# Altium schematic sheet step-dir-single.SchDoc
size A4
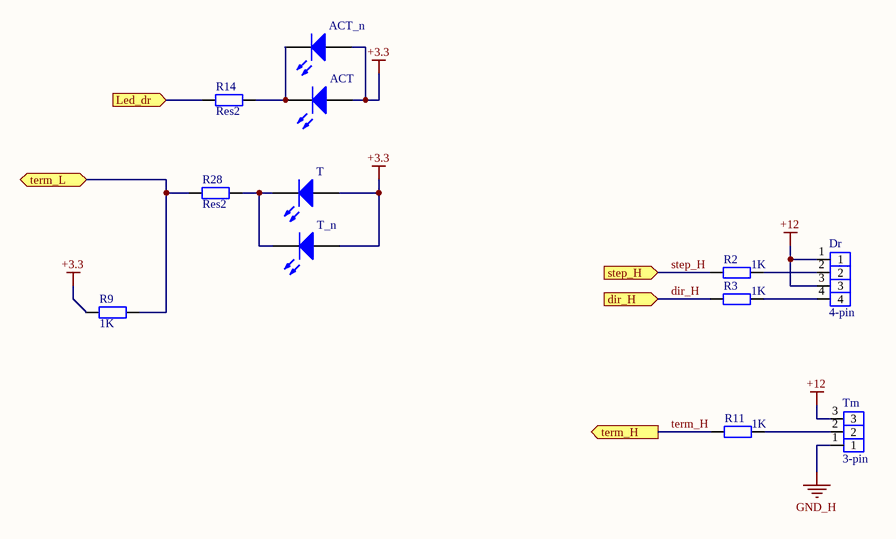
[diagram p0: step-dir-single.SchDoc]

## Parts
ACT  led  [CD2012-0805]  (value not drawn)
ACT_n  led  [led-pins]  (value not drawn)
Dr  4-pin  [CWF-4R]
R2  1K  [RESC2012M]
R3  1K  [RESC2012M]
R9  1K  [RESC2012M]
R11  1K  [RESC2012M]
R14  Res2  [RESC2012M]
R28  Res2  [RESC2012M]
T  led  [CD2012-0805]  (value not drawn)
T_n  led  [led-pins]  (value not drawn)
Tm  3-pin  [CWF-3R]

## Ports
dir_H (in), Led_dr (in), step_H (in), term_H (out), term_L (bidir)

## Nets
+3.3: ACT.1(A) ACT_n.1(A) R9.1 T.1(A) T_n.1(A)
+12: Dr.1 Dr.3 Tm.3
GND_H: Tm.1
dir_H: R3.1 ; port dir_H
Led_dr: R14.1 ; port Led_dr
step_H: R2.1 ; port step_H
term_H: R11.1 ; port term_H
term_L: R9.2 R28.1 ; port term_L
NetACT_2: ACT.2(K) ACT_n.2(K) R14.2
NetDr_2: Dr.2 R2.2
NetDr_4: Dr.4 R3.2
NetR11_2: R11.2 Tm.2
NetR28_2: R28.2 T.2(K) T_n.2(K)

## Library data of the parts
ACT ACT_n T T_n = chip led
R2 R3 R9 R11 = Res2: Resistor; Published: 8-Jun-2000; LatestRevisionDate: 17-Jul-2002; LatestRevisionNote: Re-released for DXP Platform.; PackageReference: AXIAL-0.4; Publisher: Altium Limited; PackageDescription: Axial Device, Thru-Hole; 2 Leads; 0.4 in Pin Spacing; Value: 1K
R14 R28 = Res2: Resistor; Value: 1K; Published: 8-Jun-2000; LatestRevisionDate: 17-Jul-2002; LatestRevisionNote: Re-released for DXP Platform.; PackageReference: AXIAL-0.4; Publisher: Altium Limited; PackageDescription: Axial Device, Thru-Hole; 2 Leads; 0.4 in Pin Spacing